# Altium schematic sheet PG01_ TABLE OF CONTENTS.SchDoc: BMU - Table of Contents
size B; CompanyName: Matternet; Address1: 3511 EDISON WAY; Address2: MENLO PARK, CA, 94025; DocumentNumber: 1; Revision: 4.1; SheetNumber: 1; SheetTotal: 9
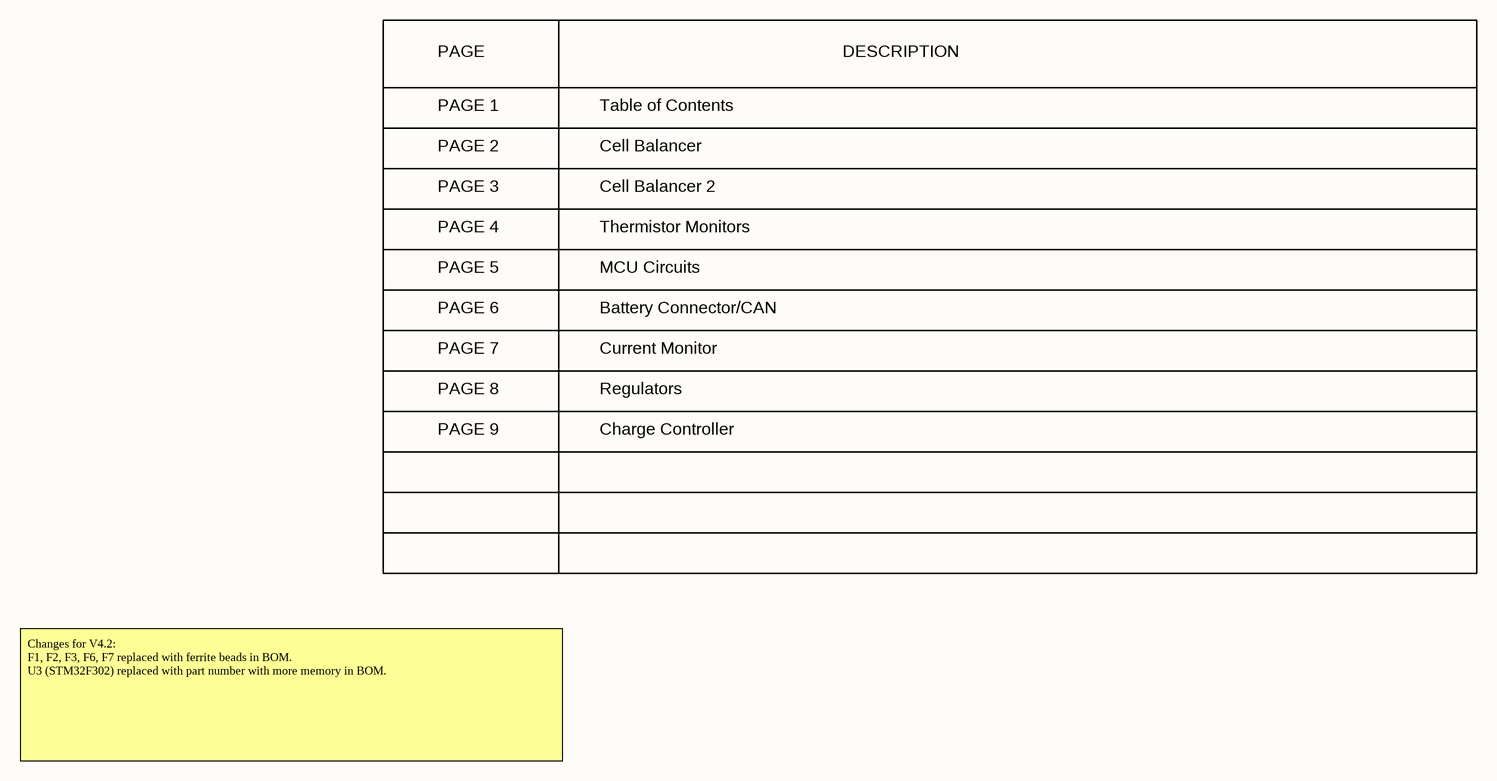
[diagram p0: PG01_ TABLE OF CONTENTS.SchDoc]

## Notes on the sheet
- PAGE
- PAGE 1
- Table of Contents
- DESCRIPTION
- PAGE 2
- Cell Balancer
- PAGE 3
- PAGE 4
- Cell Balancer 2
- Thermistor Monitors
- PAGE 5
- PAGE 6
- MCU Circuits
- Battery Connector/CAN
- PAGE 7
- Current Monitor
- PAGE 8
- PAGE 9
- Regulators
- Charge Controller
- Changes for V4.2:
  F1, F2, F3, F6, F7 replaced with ferrite beads in BOM.
  U3 (STM32F302) replaced with part number with more memory in BOM.
- Title
- Size:
- Date:
- B
- Number:
- Time:
- Revision:
- Sheet
- of
- MATTERNET
- 161 E. Evelyn Ave.
- Mountain View,
- CA 94041 USA
- PROPRIETRY & CONFIDENTIAL
  THE INFORMATION CONTAINS IN THIS DRAWING
  IS THE SOLE PROPERTY OF  MATTERNET Inc.
  ANY REPRODUCTION IN PART OR AS WHOLE
  WITHOUT A WRITTEN PERMISSION OF
  MATTERNET Inc. IS PROHIBITED
- File: